# EAGLE design DMX-Card (EAGLE 7.6.0)
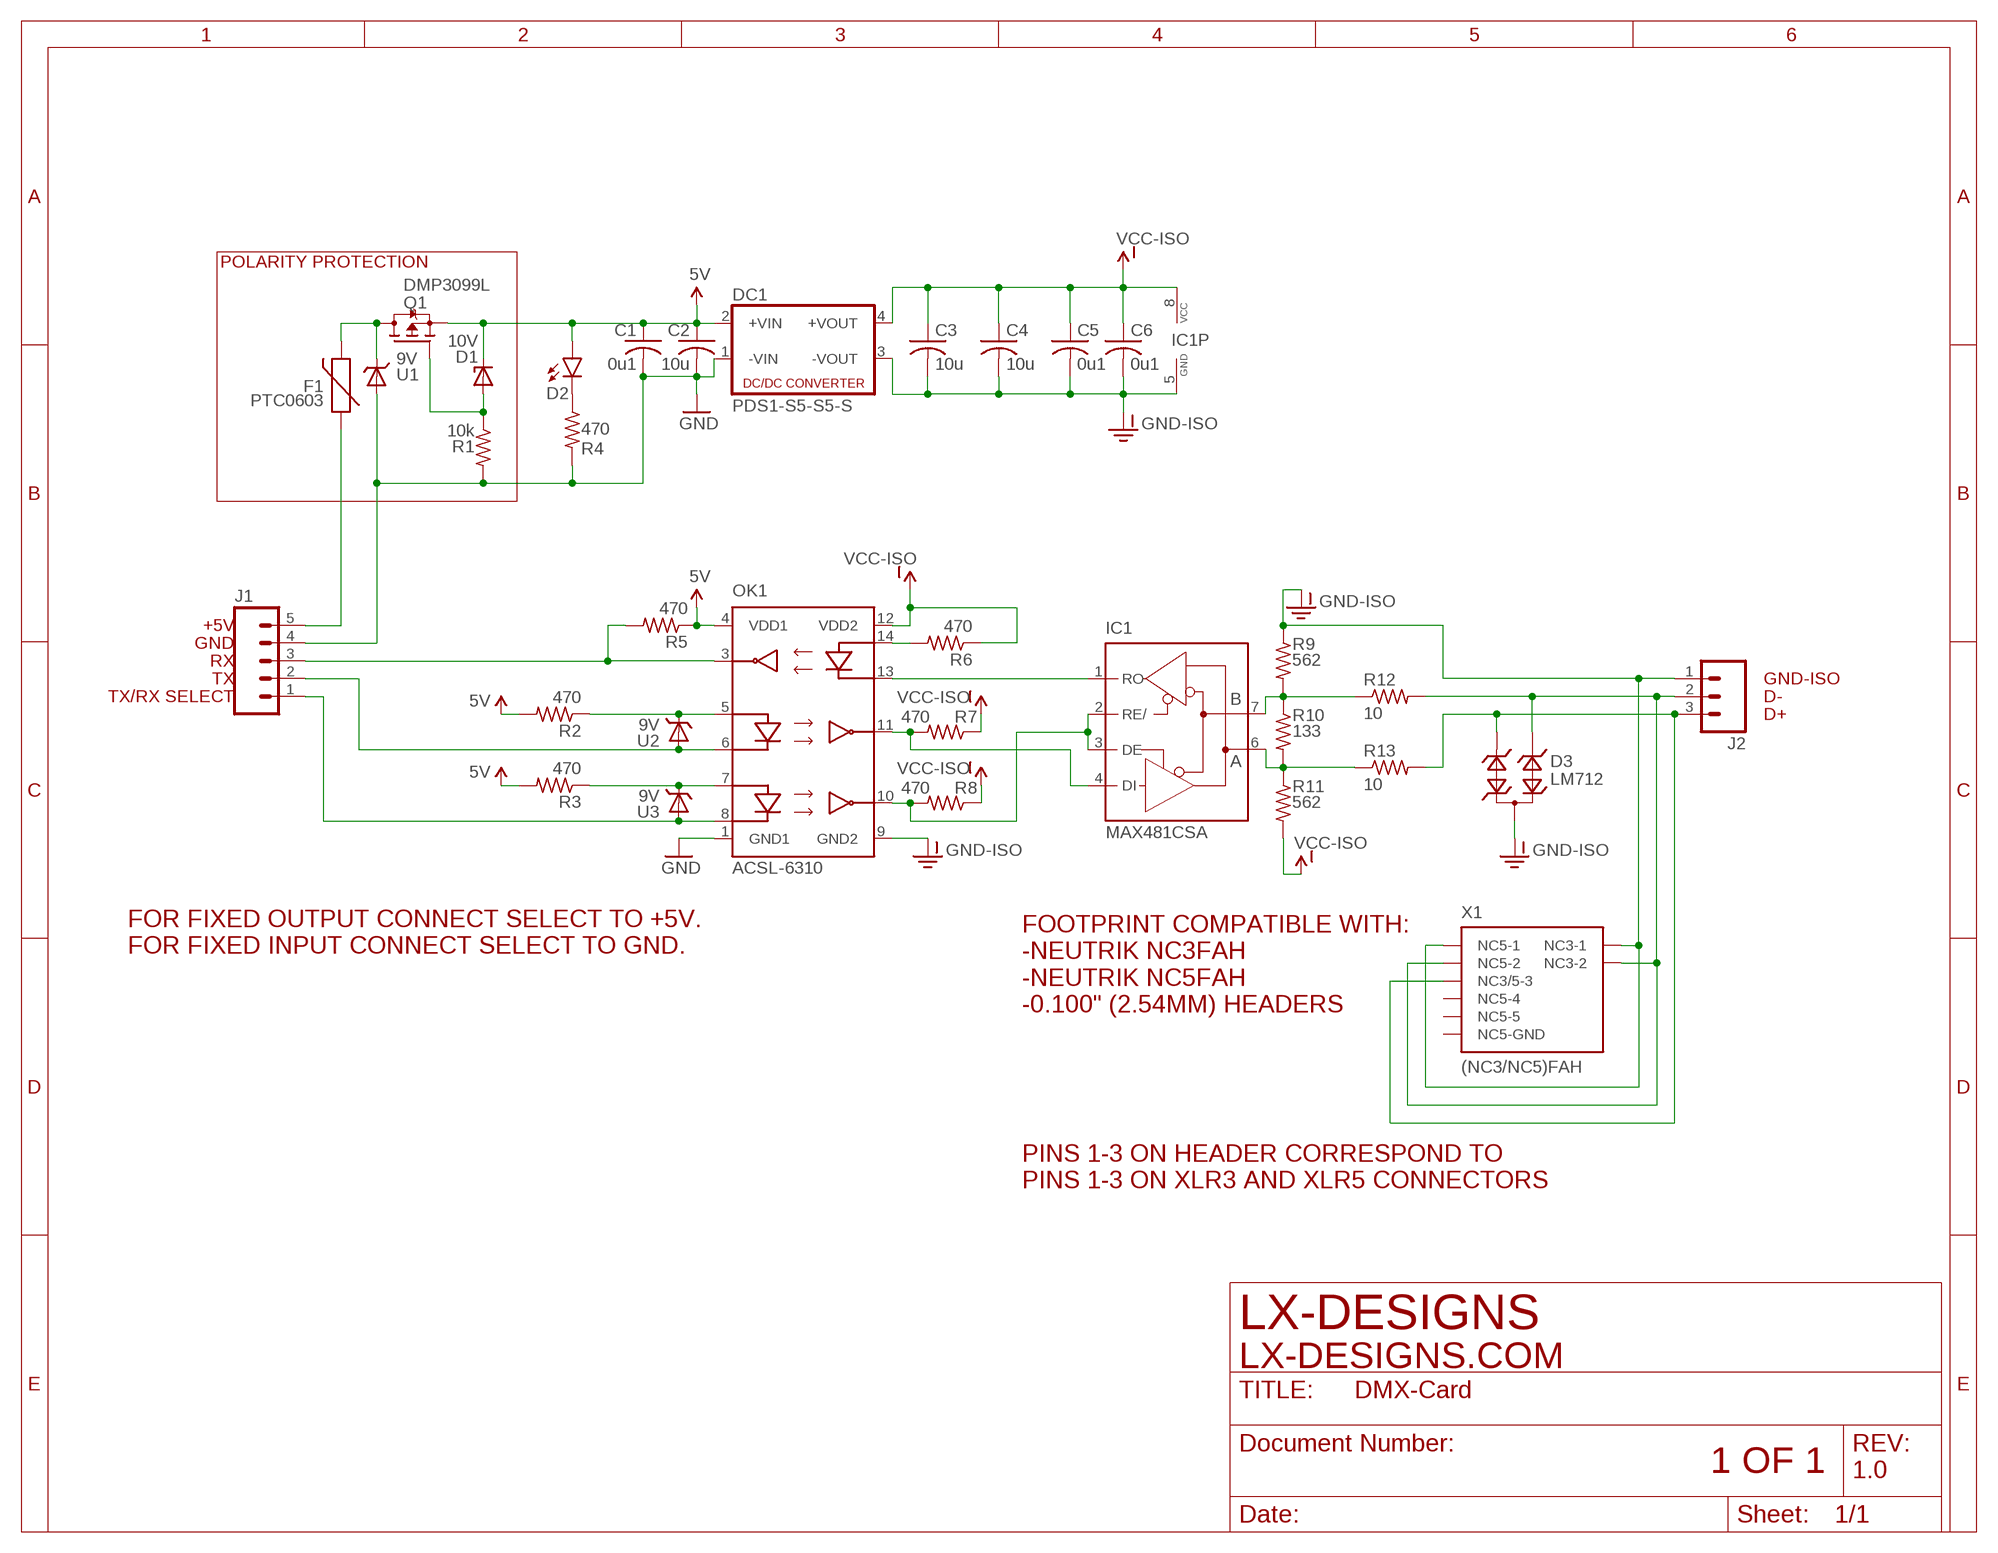
[diagram p0: schematic, sheet 1]

## Parts
C1  0u1  C-USC0603K  [C0603K]
C2  10u  C-USC0603K  [C0603K]
C3  10u  C-USC0603K  [C0603K]
C4  10u  C-USC0603K  [C0603K]
C5  0u1  C-USC0603K  [C0603K]
C6  0u1  C-USC0603K  [C0603K]
D1  10V  ZENER-DIODESOD-323  [SOD323]
D2  LED0603  [LED-0603]
D3  LM712  CDSOT23-SM712SOT23-STANDARD  [SOT23]
DC1  PDS1-S5-S5-S  VA-0505S  [4SIL]
F1  PTC0603  [0603]
IC1  MAX481CSA  [SO08]
J1  M05NO_SILK  [1X05_NO_SILK]
J2  M031X03_NO_SILK  [1X03_NO_SILK]
OK1  ACSL-6310  ACSL-60  [SO-16]
Q1  DMP3099L  BSA223SPSOT23  [SOT23]
R1  10k  R-US_R0603  [R0603]
R2  470  R-US_R0603  [R0603]
R3  470  R-US_R0603  [R0603]
R4  470  R-US_R0603  [R0603]
R5  470  R-US_R0603  [R0603]
R6  470  R-US_R0603  [R0603]
R7  470  R-US_R0603  [R0603]
R8  470  R-US_R0603  [R0603]
R9  562  R-US_R0603  [R0603]
R10  133  R-US_R0603  [R0603]
R11  562  R-US_R0603  [R0603]
R12  10  R-US_R0603  [R0603]
R13  10  R-US_R0603  [R0603]
U1  9V  TVS-DIODESOD323-NOSILK  [SOD323-NOSILK]
U2  9V  TVS-DIODESOD323-NOSILK  [SOD323-NOSILK]
U3  9V  TVS-DIODESOD323-NOSILK  [SOD323-NOSILK]
X1  (NC3/NC5)FAH  CUSTOMNC3FAH-NC3MAH-NOSILK  [NC3FAH-NC5FAH-NOSILK]

## Nets
5V: C1.1 C2.1 D1.C D2.A DC1.2(+VIN) OK1.4(VDD1) Q1.2(S) R2.2 R3.2 R5.1
D+: D3.2 J2.3 R13.2 X1.NC3-3(NC3/5-3)
D-: D3.1 J2.2 R12.2 X1.NC3-2 X1.NC5-2
GND: C1.2 C2.2 DC1.1(-VIN) J1.4 OK1.1(GND1) R1.2 R4.2 U1.A
GND-ISO: C3.2 C4.2 C5.2 C6.2 D3.3 DC1.3(-VOUT) IC1.5(GND) J2.1 OK1.9(GND2) R9.1 X1.NC3-1 X1.NC5-1
N$1: IC1.7(B) R9.2 R10.1 R12.1
N$2: IC1.6(A) R10.2 R11.1 R13.1
N$3: F1.1 J1.5
N$4: D2.C R4.1
N$5: IC1.1(RO) OK1.13(C3)
N$6: OK1.5(A1) R2.1 U2.C
N$9: OK1.14(A3) R6.2
N$10: J1.3 OK1.3(V03) R5.2
N$11: IC1.4(DI) OK1.11(VO1) R7.2
N$12: OK1.7(A2) R3.1 U3.C
N$13: J1.2 OK1.6(C1) U2.A
N$14: F1.2 Q1.3(D) U1.C
N$15: J1.1 OK1.8(C2) U3.A
N$17: D1.A Q1.1(G) R1.1
OPTO-OUT: IC1.2(RE/) IC1.3(DE) OK1.10(VO2) R8.2
VCC-ISO: C3.1 C4.1 C5.1 C6.1 DC1.4(+VOUT) IC1.8(VCC) OK1.12(VDD2) R6.1 R7.1 R8.1 R11.2
Unconnected: X1.GND(NC5-GND) X1.NC5-4 X1.NC5-5

## Notes on the sheet
- POLARITY PROTECTION
- +5V
- GND
- RX
- TX | GND-ISO
- TX/RX SELECT | D-
- D+
- FOR FIXED OUTPUT CONNECT SELECT TO +5V.
  FOR FIXED INPUT CONNECT SELECT TO GND.
- FOOTPRINT COMPATIBLE WITH:
  -NEUTRIK NC3FAH
  -NEUTRIK NC5FAH
  -0.100" (2.54MM) HEADERS
- PINS 1-3 ON HEADER CORRESPOND TO
  PINS 1-3 ON XLR3 AND XLR5 CONNECTORS
- LX-DESIGNS
- LX-DESIGNS.COM
- 1 OF 1 | 1.0

## Library data of the parts
C1-C6 = rcl:C-US: CAPACITOR, American symbol
D1 = diode:ZENER-DIODE: Z-Diode
D2 = SparkFun-LED:LED: LEDs Standard schematic elements and footprints for 5mm, 3mm, 1206, and 0603 sized LEDs. 5mm - Spark Fun Electronics SKU : COM-00529 (and others)
D3 = diode:CDSOT23-SM712
DC1 = dc-dc-converter:VA-*?: DC DC Converter Single Output, 1 Watt Motien Technology Co.,Ltd. Source: Data sheet <http://www.motien.com.tw/data_sheet/VA-1%28H%29.pdf>; OC_FARNELL: unknown; OC_NEWARK: unknown
F1 = SparkFun-PowerIC:PTC: Resettable Fuse PTC Resettable Fuse. Spark Fun Electronics SKU : COM-08357
IC1 = maxim:MAX481CSA: RS485 TRANSEIVER; MF: MAXIM; MPN: MAX481CSA; OC_FARNELL: unknown; OC_NEWARK: 90C3817
J1 = SparkFun-Connectors:M05: Header 5 Standard 5-pin 0.1" header. Use with straight break away headers (SKU : PRT-00116), right angle break away headers (PRT-00553), swiss pins (PRT-00743), machine pins (PRT-00117), and female headers (PRT-00115). Molex polarized connector foot print use with SKU : PRT-08230 with associated crimp pins and housings.
J2 = SparkFun-Connectors:M03: Header 3 Standard 3-pin 0.1" header. Use with straight break away headers (SKU : PRT-00116), right angle break away headers (PRT-00553), swiss pins (PRT-00743), machine pins (PRT-00117), and female headers (PRT-00115). Molex polarized connector foot print use with SKU : PRT-08232 with associated crimp pins and housings.
OK1 = optocoupler:ACSL-6**0: MULTI-CHANNEL AND BI-DIRECTIONAL 15MBd OPTOCPUPLER
Q1 = transistor-fet:BSA223SP: OptiMOS(R)-P Small-Signal-Transistor P-Channel, Enhancement mode, Super Logic Level (2.5 V rated) Source: http://www.infineon.com/upload/Document/BSA223SP_Rev1.3.pdf
R1-R13 = rcl:R-US_: RESISTOR, American symbol
U1-U3 = diode:TVS-DIODE
X1 = con-neutrik_ag:CUSTOM

## Board
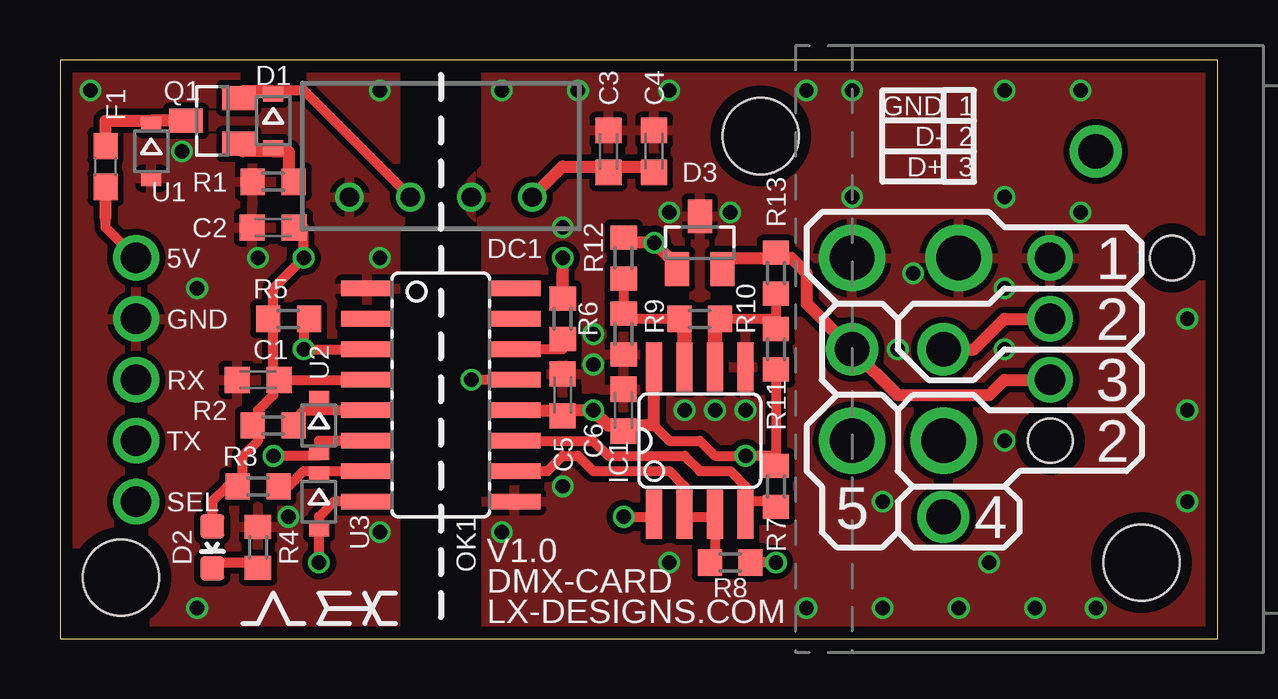
[diagram p1: board, top side]
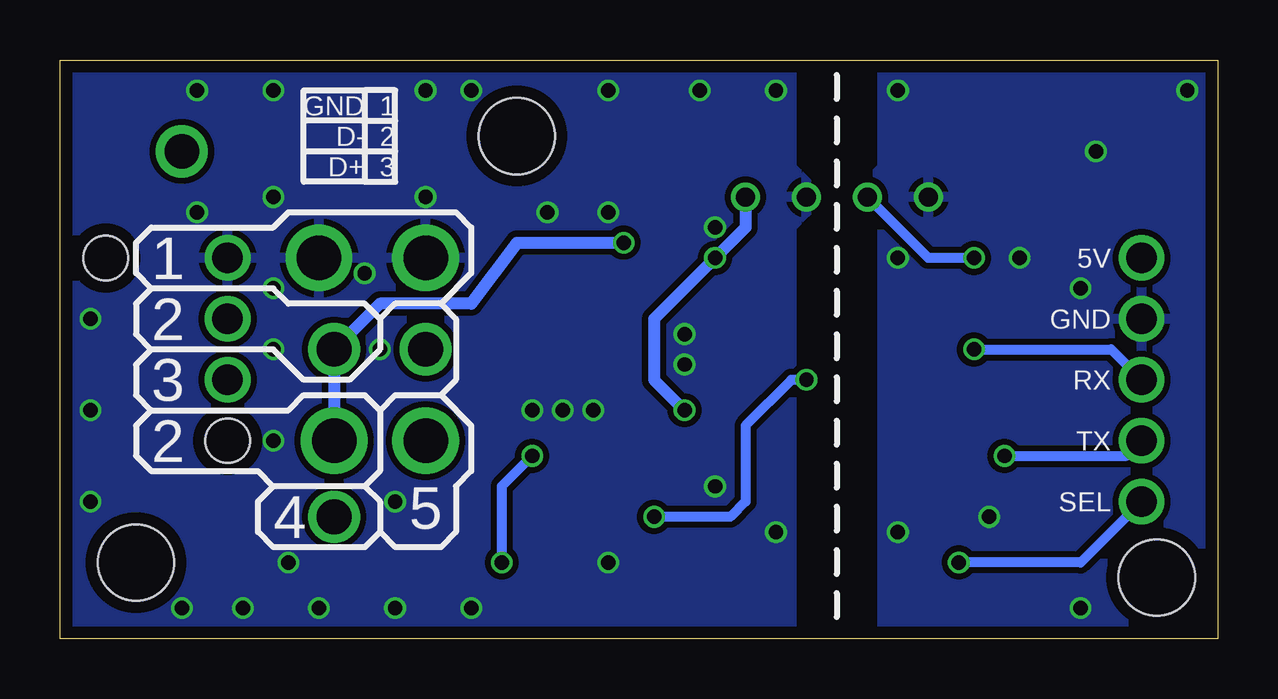
[diagram p2: board, bottom side, seen from below]

Size 48.26 x 24.13 mm. Coordinates in mm from the lower left corner, seen from the top.
Outline: 0,24.13 0,0 48.26,0 48.26,24.13 0,24.13
Copper layers (1*16): Top 0.035mm / dielectric 1.6mm / Bottom 0.035mm
Design rules "Elecrow_2-layer_PCB_eagle_rule": minimum track width 6mil, minimum drill 12mil, track to track 6mil, track to pad 6mil, pad to pad 6mil, via to via 8mil, smd to smd 0mil, copper to edge 20mil, drill to drill 10mil, minimum pad ring 6mil, minimum via ring 6mil, stop-mask expansion 0mil, vias tented up to drill 100mil, thermal gap 10mil
Holes 3.17 mm at 2.54,2.54 29.21,20.95 45.09,3.17

### Footprints (pad centres in the part's own frame; a part is rotated, then mirrored left to right if it is on the bottom)
C0603K = smd 1.05 x 1.08: 1 -0.875,0; 2 0.875,0
SOD323 = smd 0.63 x 0.83: A 1.115,0; C -1.115,0
LED-0603 = smd 1 x 1: A 0,-0.877; C 0,0.877
SOT23 = smd 1 x 1.4: 1 -0.95,-1.1; 2 0.95,-1.1; 3 0,1.1
4SIL = drill 0.8: 1 -3.81,0; 2 -1.27,0; 3 1.27,0; 4 3.81,0
0603 = smd 1.1 x 1: 1 -0.85,0; 2 0.85,0
SO08 = smd 0.66 x 2.032: 1 -1.905,-3.073; 2 -0.635,-3.073; 3 0.635,-3.073; 4 1.905,-3.073; 5 1.905,3.073; 6 0.635,3.073; 7 -0.635,3.073; 8 -1.905,3.073
1X05_NO_SILK = drill 1.27 pad 1.88: 1 0,0; 2 2.54,0; 3 5.08,0; 4 7.62,0; 5 10.16,0
1X03_NO_SILK = drill 1.27 pad 1.88: 1 0,0; 2 2.54,0; 3 5.08,0
SO-16 = smd 0.635 x 2.159: 1 -4.445,-3.073; 2 -3.175,-3.073; 3 -1.905,-3.073; 4 -0.635,-3.073; 5 0.635,-3.073; 6 1.905,-3.073; 7 3.175,-3.073; 8 4.445,-3.073; 9 4.445,3.073; 10 3.175,3.073; 11 1.905,3.073; 12 0.635,3.073; 13 -0.635,3.073; 14 -1.905,3.073; 15 -3.175,3.073; 16 -4.445,3.073
R0603 = smd 1 x 1.1: 1 -0.85,0; 2 0.85,0
SOD323-NOSILK = smd 0.63 x 0.83: A 1.125,0; C -1.125,0
NC3FAH-NC5FAH-NOSILK = drill 1.448: GND -8.255,10.16; NC3-3 0,0; NC5-2 0,3.81; NC5-4 6.985,3.81 | drill 1.854: NC3-1 -3.81,4.445; NC3-2 3.81,3.81; NC5-1 -3.81,0; NC5-5 3.81,0 | hole 1.854: 3.81,8.255; -3.81,13.335

### Placement (x,y rotation side)
C1  8.26,10.79 180 top
C2  8.89,17.14 180 top
C3  22.86,20.32 90 top
C4  24.77,20.32 90 top
C5  20.95,10.16 90 top
C6  23.5,9.53 90 top
D1  8.89,21.59 270 top
D2  6.35,3.81 180 top
D3  26.67,16.51 0 top
DC1  15.88,18.41 0 top
F1  1.91,19.68 90 top
IC1  26.67,8.26 0 top
J1  3.17,5.71 90 top
J2  41.27,15.88 270 top
OK1  15.88,10.16 270 top
Q1  6.35,21.59 90 top
R1  8.89,19.05 180 top
R2  8.89,8.89 180 top
R3  8.26,6.35 180 top
R4  8.26,3.81 90 top
R5  9.53,13.34 0 top
R6  20.95,13.34 270 top
R7  29.84,6.35 270 top
R8  27.94,3.17 180 top
R9  23.5,12.7 90 top
R10  26.67,13.34 0 top
R11  29.84,12.06 270 top
R12  23.5,15.88 90 top
R13  29.84,15.24 90 top
U1  3.81,20.32 270 top
U2  10.79,8.89 270 top
U3  10.79,5.71 270 top
X1  33.02,12.06 270 top

### Tracks (layer width: path | path; a pad name or v marks a point on that pad's centre or on a via)
5V  (via drill 0.6)
  Top 0.406: R2.2 8.26,8.89 | 8.26,8.89 8.26,9.53 8.89,10.16 8.89,10.79 | 8.89,10.79 C1.1 OK1.4 | 8.89,10.79 8.89,13.34 | DC1.2 10.16,22.86 8.89,22.86 | D1.C 8.89,22.86 | 8.89,22.86 7.62,22.86 7.62,22.71 Q1.2 | 8.89,13.34 8.89,14.61 v10.16,15.88 10.16,17.14 C2.1 | R5.1 8.89,13.34 | D2.A 6.35,5.71 6.99,6.35 R3.2 7.62,6.35 7.62,7.62 8.26,8.26 8.26,8.89
  Bottom 0.406: v10.16,15.88 12.06,15.88 DC1.2
D+
  Top 0.508: D3.2 27.62,15.55 27.94,15.88 29.84,15.88 | R13.2 29.84,15.88 | 29.84,15.88 30.48,15.88 31.11,15.24 31.11,13.97 X1.NC3-3 34.92,10.16 38.73,10.16 39.37,10.79 J2.3
D-  (via drill 0.6)
  Top 0.508: R12.2 23.5,16.51 v24.77,16.51 25.72,15.55 D3.1 | X1.NC5-2 38.1,12.06 39.37,13.34 J2.2
  Bottom 0.508: X1.NC3-2 X1.NC5-2 34.92,13.97 31.11,13.97 29.21,16.51 v24.77,16.51
GND  (via drill 0.6)
  other vias: 13.34,22.86 1.27,22.86 13.34,4.45 5.08,20.32 5.71,1.27 5.71,14.61 13.34,15.88 9.53,5.08 8.26,15.88
  pour Bottom (isolate 0.254): 13.97,0 13.97,17.14 14.61,17.78 14.61,19.05 13.97,19.68 13.97,24.13 0,24.13 0,0
  pour Top (isolate 0.254): 0,24.13 13.97,24.13 13.97,19.68 14.61,19.05 14.61,17.78 13.97,17.14 13.97,0 0,0
GND-ISO  (via drill 0.6)
  Top 0.508: 28.57,11.04 IC1.5
  other vias: 27.3,9.53 22.23,11.43 26.04,9.53 22.23,12.7 18.41,22.86 18.41,4.45 27.94,17.78 25.4,17.78 25.4,3.17 34.29,1.27 37.47,1.27 40.64,1.27 34.29,5.71 38.73,3.17 39.37,8.26 34.92,12.06 33.02,18.41 39.37,18.41 42.55,17.78 21.59,22.86 35.56,15.24 39.37,14.61 46.99,5.71 46.99,9.53 46.99,13.34 43.18,1.27 28.57,9.53 20.95,6.35 33.02,22.86 39.37,22.86 42.55,22.86 31.11,22.86 25.4,22.86 31.11,1.27 39.37,12.06 20.95,17.14
  pour Bottom (isolate 0.254): 17.78,24.13 17.78,19.68 17.14,19.05 17.14,17.78 17.78,17.14 17.78,0 48.26,0 48.26,24.13
  pour Top (isolate 0.254): 48.26,24.13 48.26,0 17.78,0 17.78,17.14 17.14,17.78 17.14,19.05 17.78,19.68 17.78,24.13
N$1
  Top 0.406: R12.1 R9.2 23.5,13.34 R10.1
  Top 0.508: R10.1 26.04,13.34
  Top 0.61: IC1.7 26.04,13.34
N$2
  Top 0.406: R13.1 R11.1 29.84,13.34 R10.2
  Top 0.508: 27.3,13.34 R10.2
  Top 0.61: IC1.6 27.3,13.34
N$3
  Top 0.406: J1.5 1.91,17.14 F1.1
  Top 0.508: 1.91,17.57 F1.1
N$4
  Top 0.406: R4.1 8.26,3.17 6.35,3.17 D2.C
N$5  (via drill 0.6)
  Top 0.406: OK1.13 v17.14,10.79 | IC1.1 24.66,5.08 v23.5,5.08
  Bottom 0.406: v17.14,10.79 17.78,10.79 19.68,8.89 19.68,5.71 20.32,5.08 v23.5,5.08
N$6
  Top 0.406: OK1.5 10.79,9.53 | 10.79,9.53 U2.C | R2.1 9.53,8.89 10.16,9.53 10.79,9.53
N$9
  Top 0.406: R6.2 20.95,12.06 OK1.14
N$10  (via drill 0.6)
  Top 0.406: OK1.3 v10.16,12.06 10.16,13.34 R5.2
  Bottom 0.406: v10.16,12.06 4.45,12.06 J1.3
N$11
  Top 0.406: OK1.11 22.23,8.26 22.86,7.62 26.04,7.62 26.67,6.99 27.94,6.99 28.57,6.35 28.57,5.71 | 28.57,5.71 IC1.4 | 28.57,5.71 29.84,5.71 R7.2
N$12
  Top 0.406: 8.89,6.35 R3.1 9.53,6.35 10.16,6.99 10.79,6.99 | U3.C 10.79,6.99 | 10.79,6.99 OK1.7
N$13  (via drill 0.6)
  Top 0.406: v8.89,7.62 10.79,7.62 U2.A 10.79,8.26 OK1.6
  Bottom 0.406: v8.89,7.62 3.81,7.62 J1.2
N$14
  Top 0.508: 3.81,21.59 U1.C | F1.2 1.91,21.59 3.81,21.59 | Q1.3 3.81,21.59
N$15  (via drill 0.6)
  Top 0.406: OK1.8 11.43,5.71 10.79,5.08 U3.A v10.79,3.17
  Bottom 0.406: J1.1 5.71,3.17 v10.79,3.17
N$17
  Top 0.406: 9.53,19.05 R1.1
  Top 0.508: 9.53,19.05 9.53,20.32 8.89,20.32 | D1.A 8.89,20.32 | 8.89,20.32 7.62,20.32 7.45,20.49 Q1.1
OPTO-OUT
  Top 0.406: R8.2 27.3,3.17 IC1.3 27.2,5.08 26.04,5.08 | 26.04,4.45 26.04,5.08 | OK1.10 20.32,6.99 20.95,7.62 21.59,7.62 22.23,6.99 25.4,6.99 26.04,6.35 IC1.2 26.04,5.08
VCC-ISO  (via drill 0.6)
  Top 0.406: 24.77,8.89 25.4,8.26 26.67,8.26 27.3,7.62 v28.57,7.62 29.84,7.62 R7.1 R11.2 | v29.84,3.17 R8.1
  Top 0.508: C6.1 23.73,8.89 24.77,8.89 IC1.8 | 23.5,8.89 C6.1 | OK1.12 20.95,9.53 | 20.95,9.53 C5.1 | C6.1 23.25,8.89 22.86,8.89 v22.23,9.53 20.95,9.53 | 20.95,15.24 R6.1 v20.95,15.88 | DC1.4 20.95,19.68 22.86,19.68 | 22.86,19.68 24.77,19.68 C4.1 | C3.1 22.86,19.68
  Bottom 0.406: v28.57,7.62 29.84,6.35 v29.84,3.17
  Bottom 0.508: v22.23,9.53 23.5,10.79 23.5,13.34 v20.95,15.88 19.68,17.14 DC1.4

### Text on the board
tPlace: GND | 1 | D- | 2 | D+ | 3 | 5V | 1 | GND | 2 | RX | 3 | TX | 2 | SEL | 5 | 4 | V1.0 | DMX-CARD | LX-DESIGNS.COM
bPlace: 1 | GND | 2 | D- | 3 | D+ | 5V | 1 | GND | 2 | RX | 3 | TX | 2 | SEL | 5 | 4
_tNames: Q1 | D2 | C4 | C5 | D1 | F1 | C3 | R1 | D6 | C1 | R13 | DC1 | R2 | R12 | R6 | R9 | R10 | R3 | D4 | R11 | C2 | C6 | C7 | IC1 | D3 | R4 | OK1 | R7 | D5 | R5 | R8